# EAGLE design SPv2.1 (EAGLE 7.1.0)

## Sheet 1 of 2
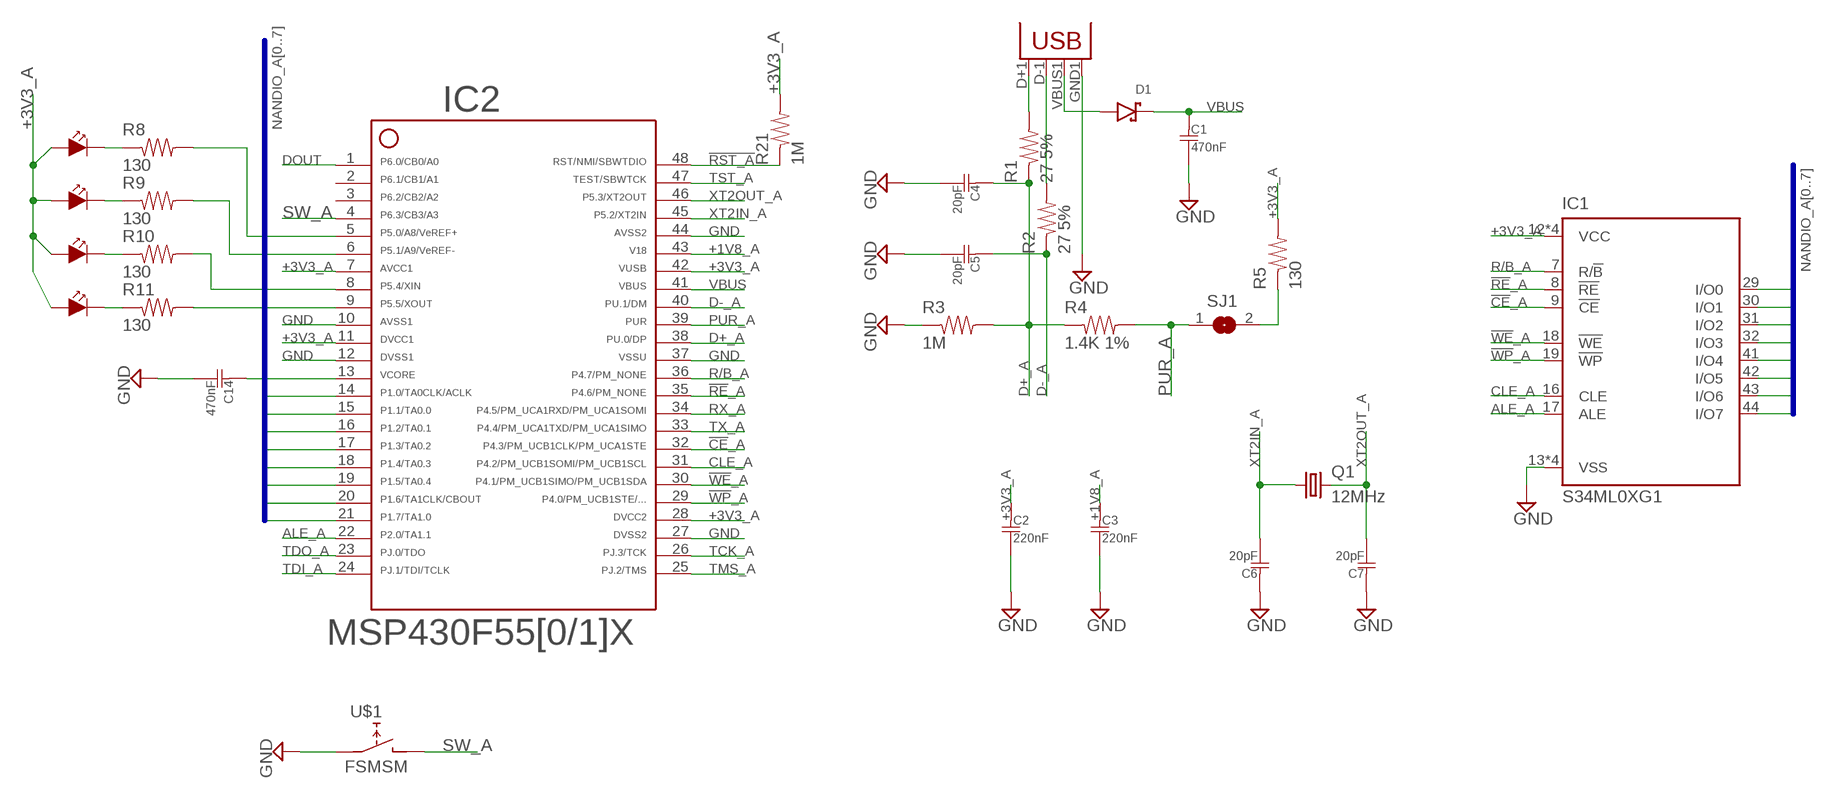
[diagram p0: schematic, sheet 1]

### Parts
C1  470nF  C0805  [R0805]
C2  220nF  C0805  [R0805]
C3  220nF  C0805  [R0805]
C4  20pF  C0805  [R0805]
C5  20pF  C0805  [R0805]
C6  20pF  C0805  [R0805]
C7  20pF  C0805  [R0805]
C14  470nF  C0805  [R0805]
D1  D-SCHOTTKY  [SOD123]
IC1  S34ML0XG1  [TSOP48]
IC2  F5508  F55[0/1]X---PT48  [PT48]
JP1  USBA-SMD-MALE  [USB-A-SMT-MALE]
Q1  12MHz  CRYSTALCSM-3X  [CSM-3X]
R1  27 5%  R0805  [R0805]
R2  27 5%  R0805  [R0805]
R3  1M  R0805  [R0805]
R4  1.4K 1%  R0805  [R0805]
R5  130  R0805  [R0805]
R8  130  R0805  [R0805]
R9  130  R0805  [R0805]
R10  130  R0805  [R0805]
R11  130  R0805  [R0805]
R21  1M  R0805  [R0805]
SJ1  SJW  [SJW]
U$1  FSMSM  [FSMSM]
U$5  LED  [LED0805]
U$6  LED  [LED0805]
U$7  LED  [LED0805]
U$8  LED  [LED0805]

### Nets
!CE!_A: IC1.9(!CE) IC2.32
!RE!_A: IC1.8(!RE) IC2.35
!RST_A!: IC2.48 R21.P$1
!WE!_A: IC1.18(!WE) IC2.30
!WP!_A: IC1.19(!WP) IC2.29
+1V8_A: C3.P$1 IC2.43
+3V3_A: C2.P$1 IC1.12(VCC) IC1.34(VCC) IC1.37(VCC) IC1.39(VCC) IC2.7 IC2.11 IC2.28 IC2.42 R5.P$2 R21.P$2 U$5.ANODE U$6.ANODE U$7.ANODE U$8.ANODE
ALE_A: IC1.17(ALE) IC2.22
CLE_A: IC1.16(CLE) IC2.31
D+_A: C4.P$1 IC2.38 R1.P$1 R3.P$2 R4.P$1
D-_A: C5.P$1 IC2.40 R2.P$1
DOUT: IC2.1 ; also sheet 2
GND: C1.P$2 C2.P$2 C3.P$2 C4.P$2 C5.P$2 C6.P$1 C7.P$1 C14.P$2 IC1.13(VSS) IC1.25(VSS) IC1.36(VSS) IC1.48(VSS) IC2.10 IC2.12 IC2.27 IC2.37 IC2.44 JP1.GND1(GND) R3.P$1 U$1.P$1(A1) ; also sheet 2
N$1: JP1.D+1(D+) R1.P$2
N$2: JP1.D-1(D-) R2.P$2
N$3: C14.P$1 IC2.13
N$4: R5.P$1 SJ1.2
N$19: IC2.9 R11.P$2
N$22: R10.P$1 U$7.CATHODE
N$23: R9.P$1 U$6.CATHODE
N$24: R8.P$1 U$5.CATHODE
N$25: R11.P$1 U$8.CATHODE
N$26: IC2.8 R10.P$2
N$27: IC2.6 R9.P$2
N$28: IC2.5 R8.P$2
N$33: D1.ANODE JP1.VBUS1(VBUS)
NANDIO_A0: IC1.29(I/O0) IC2.14
NANDIO_A1: IC1.30(I/O1) IC2.15
NANDIO_A2: IC1.31(I/O2) IC2.16
NANDIO_A3: IC1.32(I/O3) IC2.17
NANDIO_A4: IC1.41(I/O4) IC2.18
NANDIO_A5: IC1.42(I/O5) IC2.19
NANDIO_A6: IC1.43(I/O6) IC2.20
NANDIO_A7: IC1.44(I/O7) IC2.21
PUR_A: IC2.39 R4.P$2 SJ1.1
R/B_A: IC1.7(R/!B) IC2.36
RX_A: IC2.34 ; also sheet 2
SW_A: IC2.4 U$1.P$2(B)
TCK_A: IC2.26
TDI_A: IC2.24
TDO_A: IC2.23
TMS_A: IC2.25
TST_A: IC2.47
TX_A: IC2.33 ; also sheet 2
VBUS: C1.P$1 D1.CATHODE IC2.41 ; also sheet 2
XT2IN_A: C6.P$2 IC2.45 Q1.P$1
XT2OUT_A: C7.P$2 IC2.46 Q1.P$2
Unconnected: IC2.2 IC2.3

### Buses
NANDIO_A[0..7]

## Sheet 2 of 2
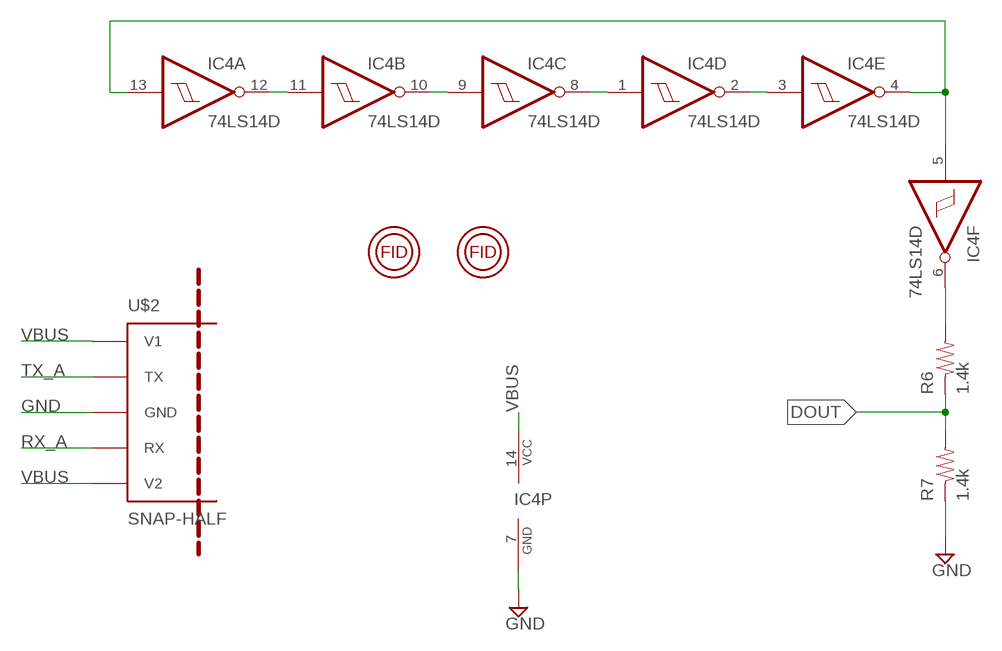
[diagram p1: schematic, sheet 2]

### Parts
IC4  74LS14D  [SO14]
R6  1.4k  R0805  [R0805]
R7  1.4k  R0805  [R0805]
U$2  SNAP-HALF  [SNAP-HALF]
U$3  FIDUCAL  [FIDUCAL]
U$12  FIDUCAL  [FIDUCAL]

### Nets
DOUT: R6.P$1 R7.P$2 ; also sheet 1
GND: IC4.7(P:GND) R7.P$1 U$2.P$3(GND) ; also sheet 1
N$5: IC4.11(B:I) IC4.12(A:O)
N$6: IC4.9(C:I) IC4.10(B:O)
N$7: IC4.1(D:I) IC4.8(C:O)
N$8: IC4.2(D:O) IC4.3(E:I)
N$9: IC4.4(E:O) IC4.5(F:I) IC4.13(A:I)
N$10: IC4.6(F:O) R6.P$2
RX_A: U$2.P$4(RX) ; also sheet 1
TX_A: U$2.P$2(TX) ; also sheet 1
VBUS: IC4.14(P:VCC) U$2.P$1(V1) U$2.P$5(V2) ; also sheet 1

## Library data of the parts
C1-C7 C14 = Passives:C
D1 = Passives:D-SCHOTTKY
IC1 = Flash:S34ML0XG1: Spansion 1GB, 2GB, and 4GB x8 NAND Flash Memory In x8 I/O mode
IC2 = TI_MSP430_v16:F55[0/1]X---PT48: ***F55[0/1/2]X*** PT48 Rev. 1.0 06/2010 "http://www.ti.com/lit/gpn/msp430f5509" Only for FF5504, F5508,F5509,F5510
IC4 = 74xx-us:74*14: Hex schmitt trigger INVERTER
JP1 = Passives:USB: USB Connectors USB-B-PTH is fully proven SKU : PRT-00139/CONN-08278 USB-miniB is fully proven SKU : PRT-00587 USB-A-PCB is untested. USB-A-H is throughly reviewed, but untested. Spark Fun Electronics SKU : PRT-00437 USB-B-SMT is throughly reviewed, but untested. Needs silkscreen touching up. USB-A-S has not been used/tested USB-MB-H has not been used/tested USB-MICROB has been used. CONN-09505
Q1 = Passives:CRYSTAL: CRYSTAL
R1-R11 R21 = Passives:R: A standard resistor.
SJ1 = jumper:SJ: SMD solder JUMPER
U$1 = Passives:FSMSM
U$2 = Passives:SNAP-HALF
U$3 U$12 = Passives:FIDUCAL
U$5-U$8 = Passives:LED

## Board
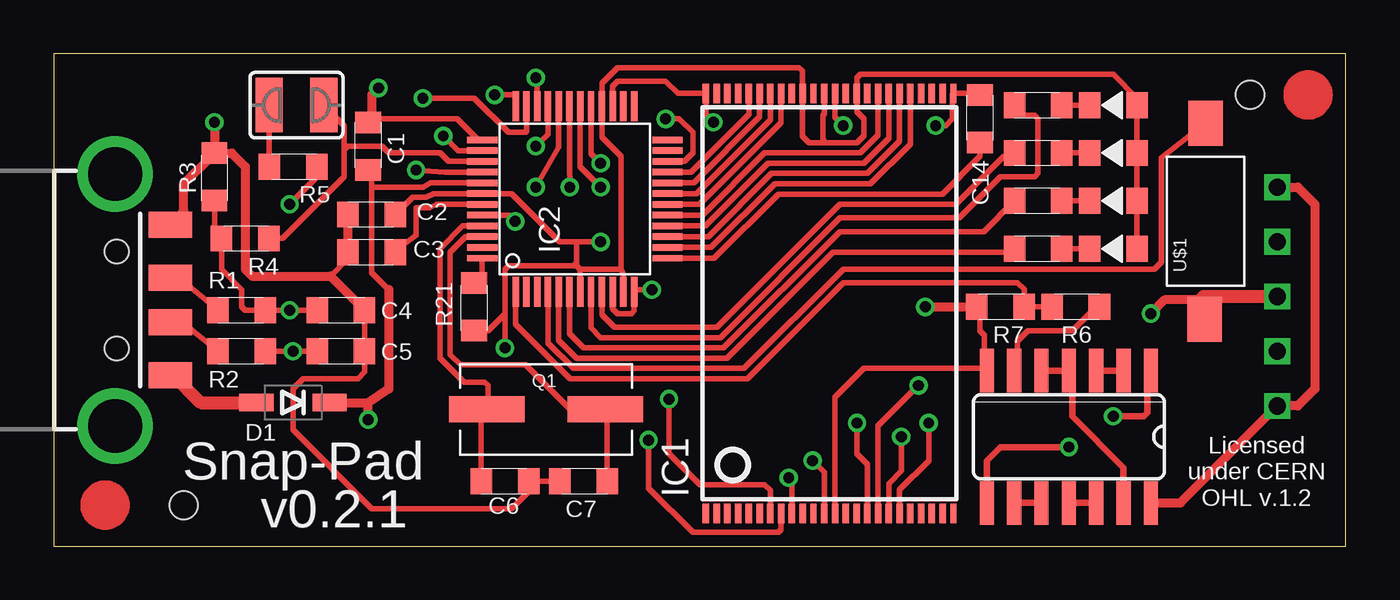
[diagram p2: board, top side]
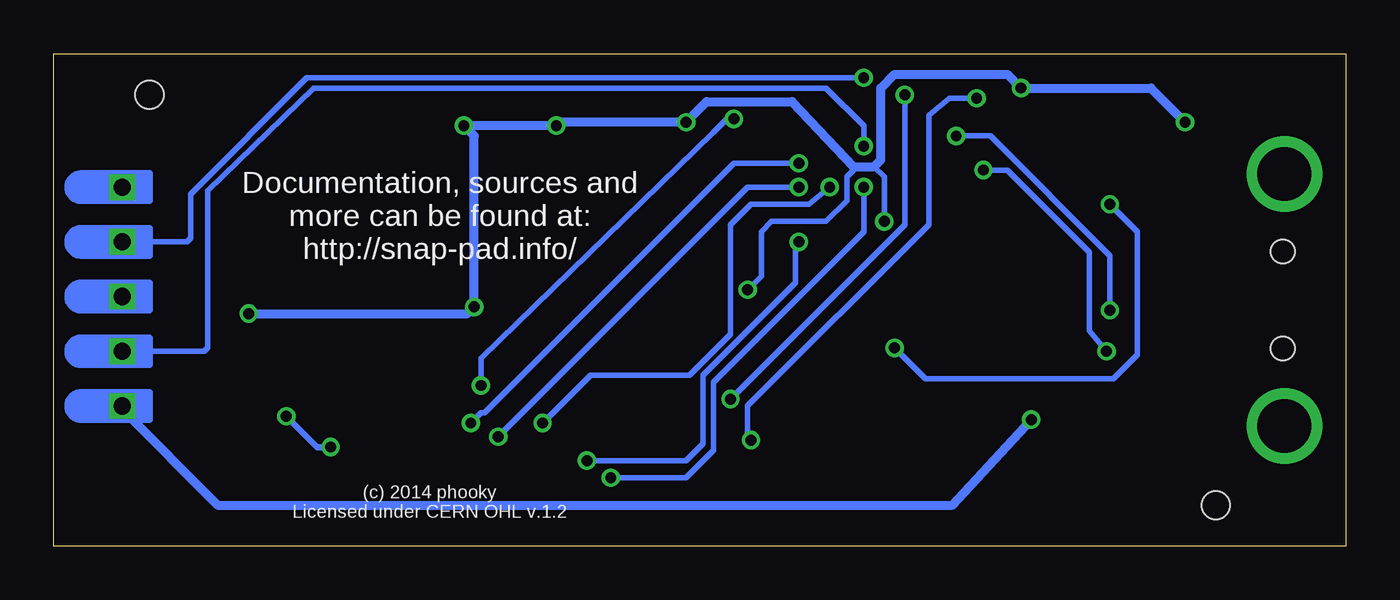
[diagram p3: board, bottom side, seen from below]

Size 60.01 x 22.86 mm. Coordinates in mm from the lower left corner, seen from the top.
Outline: 5.56,0 60.01,0 60.01,22.86 5.56,22.86 0,22.86 0,17.46 0,5.4 0,0 5.56,0
Copper layers (1*16): Top 0.0356mm / dielectric 1.5011mm / Bottom 0.0356mm
Design rules "LaenPCBOrder": minimum track width 6mil, minimum drill 13mil, track to track 6mil, track to pad 6mil, pad to pad 6mil, via to via 6mil, smd to smd 6mil, copper to edge 15mil, drill to drill 6mil, minimum pad ring 7mil, minimum via ring 7mil, stop-mask expansion 3mil, vias tented up to drill 0mil, thermal gap 10mil
Holes 1.3 mm at 6.03,1.91 55.56,20.95

### Footprints (pad centres in the part's own frame; a part is rotated, then mirrored left to right if it is on the bottom)
R0805 = smd 1 x 1.2: P$1 1.1,0; P$2 -1.1,0
SOD123 = smd 1.6 x 0.8: ANODE 1.7,0; CATHODE -1.7,0
TSOP48 = smd 0.9 x 0.3: 1 -9.75,5.75; 2 -9.75,5.25; 3 -9.75,4.75; 4 -9.75,4.25; 5 -9.75,3.75; 6 -9.75,3.25; 7 -9.75,2.75; 8 -9.75,2.25; 9 -9.75,1.75; 10 -9.75,1.25; 11 -9.75,0.75; 12 -9.75,0.25; 13 -9.75,-0.25; 14 -9.75,-0.75; 15 -9.75,-1.25; 16 -9.75,-1.75; 17 -9.75,-2.25; 18 -9.75,-2.75; 19 -9.75,-3.25; 20 -9.75,-3.75; 21 -9.75,-4.25; 22 -9.75,-4.75; 23 -9.75,-5.25; 24 -9.75,-5.75; 25 9.75,-5.75; 26 9.75,-5.25; 27 9.75,-4.75; 28 9.75,-4.25; 29 9.75,-3.75; 30 9.75,-3.25; 31 9.75,-2.75; 32 9.75,-2.25; 33 9.75,-1.75; 34 9.75,-1.25; 35 9.75,-0.75; 36 9.75,-0.25; 37 9.75,0.25; 38 9.75,0.75; 39 9.75,1.25; 40 9.75,1.75; 41 9.75,2.25; 42 9.75,2.75; 43 9.75,3.25; 44 9.75,3.75; 45 9.75,4.25; 46 9.75,4.75; 47 9.75,5.25; 48 9.75,5.75
PT48 = smd 1.4 x 0.3: 1 -4.3,2.75; 2 -4.3,2.25; 3 -4.3,1.75; 4 -4.3,1.25; 5 -4.3,0.75; 6 -4.3,0.25; 7 -4.3,-0.25; 8 -4.3,-0.75; 9 -4.3,-1.25; 10 -4.3,-1.75; 11 -4.3,-2.25; 12 -4.3,-2.75; 25 4.3,-2.75; 26 4.3,-2.25; 27 4.3,-1.75; 28 4.3,-1.25; 29 4.3,-0.75; 30 4.3,-0.25; 31 4.3,0.25; 32 4.3,0.75; 33 4.3,1.25; 34 4.3,1.75; 35 4.3,2.25; 36 4.3,2.75 | smd 0.3 x 1.4: 13 -2.75,-4.3; 14 -2.25,-4.3; 15 -1.75,-4.3; 16 -1.25,-4.3; 17 -0.75,-4.3; 18 -0.25,-4.3; 19 0.25,-4.3; 20 0.75,-4.3; 21 1.25,-4.3; 22 1.75,-4.3; 23 2.25,-4.3; 24 2.75,-4.3; 37 2.75,4.3; 38 2.25,4.3; 39 1.75,4.3; 40 1.25,4.3; 41 0.75,4.3; 42 0.25,4.3; 43 -0.25,4.3; 44 -0.75,4.3; 45 -1.25,4.3; 46 -1.75,4.3; 47 -2.25,4.3; 48 -2.75,4.3
SO14 = smd 0.66 x 2.032: 1 -3.81,-3.073; 2 -2.54,-3.073; 3 -1.27,-3.073; 4 0,-3.073; 5 1.27,-3.073; 6 2.54,-3.073; 7 3.81,-3.073; 8 3.81,3.073; 9 2.54,3.073; 10 1.27,3.073; 11 0,3.073; 12 -1.27,3.073; 13 -2.54,3.073; 14 -3.81,3.073
USB-A-SMT-MALE = smd 1.2 x 2: D+1 1.027,-3.67; D-1 -1.027,-3.67; GND1 3.5,-3.67; VBUS1 -3.5,-3.67 | drill 2.5 pad 2.9: P$1 -5.85,-1.1; P$2 5.85,-1.1 | hole 1.1: 2.25,-1.17; -2.25,-1.17
CSM-3X = smd 3.5 x 1.2: P$1 -2.75,0; P$2 2.75,0
SJW = smd 1.27 x 2.54: 1 -1.27,0; 2 1.27,0
FSMSM = smd 2.1 x 1.6: P$1 -4.55,0.05; P$2 4.55,0
SNAP-HALF = drill 0.8 square: P$1 -3.81,5.08; P$2 -3.81,2.54; P$3 -3.81,0; P$4 -3.81,-2.54; P$5 -3.81,-5.08
LED0805 = smd 1 x 1.2: ANODE -1.1,0; CATHODE 1.1,0

### Placement (x,y rotation side)
C1  14.61,18.57 270 top
C2  14.76,15.4 0 top
C3  14.76,13.65 0 top
C4  13.34,10.95 180 top
C5  13.34,9.05 180 top
C6  20.95,3.02 0 top
C7  24.61,3.02 180 top
C14  43.02,19.84 270 top
D1  11.11,6.67 180 top
IC1  36.04,11.27 90 top
IC2  24.2,16.12 90 top
IC4  47.15,5.08 180 top
JP1  1.75,11.43 90 top
Q1  22.86,6.35 0 top
R1  8.73,10.95 0 top
R2  8.73,9.05 0 top
R3  7.46,17.14 90 top
R4  8.89,14.29 180 top
R5  11.11,17.62 180 top
R6  47.47,11.11 180 top
R7  43.97,11.11 180 top
R8  45.72,13.81 0 top
R9  45.72,16.03 0 top
R10  45.72,20.48 0 top
R11  45.72,18.26 0 top
R21  19.53,11.11 90 top
SJ1  11.27,20.48 180 top
U$1  53.5,15.08 90 top
U$2  60.64,11.59 180 bottom
U$3  2.38,1.91 0 top
U$5  49.21,13.81 180 top
U$6  49.21,16.03 180 top
U$7  49.21,20.48 180 top
U$8  49.21,18.26 180 top
U$12  58.26,20.95 0 top

### Tracks (layer width: path | path; a pad name or v marks a point on that pad's centre or on a via)
!CE!_A  (via drill 0.5)
  Top 0.254: IC2.32 23.45,18.53 v22.38,16.67 | v34.13,3.17 34.29,3.02 IC1.9
  Bottom 0.254: v22.38,16.67 22.38,14.61 29.37,7.62 29.37,4.45 30.64,3.17 v34.13,3.17
!RE!_A  (via drill 0.5)
  Top 0.254: IC2.35 21.95,19.25 21.91,19.21 21.11,19.21 19.53,20.8 v17.14,20.8 | v27.62,4.92 27.62,2.7 29.69,0.64 33.66,0.64 33.79,0.77 IC1.8
  Bottom 0.254: v17.14,20.8 18.41,20.8 19.37,20 19.37,14.92 27.78,6.51 27.78,5.08 v27.62,4.92
!RST_A!
  Top 0.254: IC2.48 19.9,12.59 R21.P$1
!WE!_A  (via drill 0.5)
  Top 0.254: IC2.30 24.45,17.61 v25.4,16.67 | v39.37,5.08 39.37,3.49 38.79,2.91 IC1.18
  Bottom 0.254: v25.4,16.67 27.78,16.67 v39.37,5.08
!WP!_A  (via drill 0.5)
  Top 0.254: IC2.29 24.95,18.23 v25.4,17.78 | v40.64,5.71 40.64,3.97 39.29,2.62 IC1.19
  Bottom 0.254: v25.4,17.78 28.42,17.78 40.01,6.19 40.16,6.19 v40.64,5.71
+1V8_A
  Top 0.254: IC2.43 17.77,15.87 17.46,15.72 16.83,15.72 16.83,14.45 16.19,13.98 C3.P$1
+3V3_A  (via drill 0.5)
  Top 0.254: IC2.11 26.45,12.6 26.35,12.86 | 26.35,12.86 24.45,12.86 | IC2.7 24.45,12.55 24.45,12.86 | U$5.ANODE U$6.ANODE U$8.ANODE U$7.ANODE 50.31,20.81 49.21,21.91 37.47,21.91 37.31,21.75 37.31,21.04 IC1.34 37.31,21 37.31,20.16 37.62,19.84 37.62,19.05 37.31,18.73 35.88,18.73 | IC1.37 35.79,20.07 35.72,20 35.72,18.89 35.88,18.73 | 35.88,18.73 35.08,18.73 34.79,19.03 IC1.39 34.77,21.04 34.77,22.07 34.61,22.23 26.19,22.23 25.45,21.48 IC2.28 25.45,19 26.35,18.1 26.35,12.86 | C2.P$1 16.66,16.19 17.3,16.19 17.64,16.37 IC2.42 21.25,16.37 23.5,14.13 24.29,14.13 | 24.45,12.86 24.29,13.02 24.29,13.18 | 24.29,14.13 24.29,13.18 | IC1.12 35.79,3.42 v35.24,3.97 | v25.4,14.13 24.29,14.13 | R21.P$2 20.17,10.01 20.95,10.79 | 20.95,10.79 20.95,12.86 21.11,13.02 24.13,13.02 24.29,13.18 | R5.P$2 12.21,17.13 v10.95,15.88 | v20.95,9.21 20.95,10.79
  Bottom 0.254: v35.24,3.97 30.64,3.97 29.84,4.76 29.84,7.94 25.56,12.22 25.56,13.97 v25.4,14.13 | v10.95,15.88 9.68,14.61 9.68,8.89 10.79,7.78 19.53,7.78 v20.95,9.21
ALE_A  (via drill 0.5)
  Top 0.254: IC1.17 38.29,5.58 v40.16,7.46 | v28.42,19.84 29.05,19.84 29.69,19.21 29.69,18.26 29.3,17.87 IC2.22
  Bottom 0.254: v40.16,7.46 40.16,8.73 29.37,19.21 28.73,19.84 v28.42,19.84
CLE_A  (via drill 0.5)
  Top 0.254: IC2.31 23.95,17.76 v23.97,16.67 | IC1.16 37.79,3.81 37.31,4.29 v37.31,5.71
  Bottom 0.254: v23.97,16.67 24.92,15.88 27.62,15.88 28.57,14.92 28.57,9.84 30.48,7.94 35.08,7.94 v37.31,5.71
D+_A  (via drill 0.5)
  Top 0.254: C4.P$1 v10.95,10.95 R1.P$1 8.89,10.95 8.73,11.11 8.73,11.91 7.79,12.85 R4.P$1 7.46,14.62 R3.P$2 | IC2.38 18.78,18.37 v18.1,19.05
  Bottom 0.254: 10.95,11.34 v10.95,10.95 10.95,13.49 16.51,19.05 v18.1,19.05
D-_A  (via drill 0.5)
  Top 0.254: IC2.40 18.19,17.37 v16.83,17.46 | C5.P$1 v11.11,9.05 R2.P$1
  Bottom 0.254: v16.83,17.46 15.72,17.46 11.91,13.65 11.91,10 v11.11,9.05
DOUT
  Top 0.254: IC2.1 21.45,10.3 23.81,7.94 23.97,7.78 32.23,7.78 36.67,12.22 44.77,12.22 45.07,11.92 R7.P$2 R6.P$1
GND  (via drill 0.5)
  Top 0.254: IC2.10 25.95,11.04 26.19,10.79 26.83,10.79 26.95,10.92 IC2.12 27.04,11.91 v27.78,11.91 | IC1.36 36.29,19.91 v36.67,19.53 | v40.96,19.53 41.43,19.53 41.75,19.84 41.75,20.99 IC1.25 42.94,21.02 C14.P$2 | IC1.13 36.29,6.92 37.62,8.26 43.24,8.26 | 43.24,8.26 IC4.7 | IC2.27 25.95,21.35 26.19,21.59 28.42,21.59 28.98,21.02 IC1.48 30.29,20.04 v30.64,19.68 | IC2.37 19.71,18.87 18.73,19.84 14.78,19.84 C1.P$2 | C4.P$2 C5.P$2 14.45,9.04 14.45,8.1 14.13,7.78 11.59,7.78 11.11,7.3 11.11,5.4 14.76,1.75 21.27,1.75 22.05,2.53 C6.P$1 C7.P$1 | 43.24,8.26 43.24,9.79 43.02,10 43.02,10.96 R7.P$1 | C3.P$2 13.66,13.36 12.85,12.54 | IC2.44 21.14,15.37 v21.43,15.08
  Top 0.406: JP1.GND1 5.41,14.93 6.03,15.56 6.03,16.82 R3.P$1 | R3.P$1 8.27,18.25 8.89,17.62 8.89,12.86 9.21,12.54 12.85,12.54 C4.P$2 14.62,11.13 | C3.P$2 C2.P$2 | 53.24,11.43 51.59,11.43 v50.96,10.79 | v40.48,11.11 R7.P$1 | v7.46,19.68 R3.P$1 | 14.78,19.84 14.78,20.97 v15.08,21.27
  Top 0.61: 53.24,11.43 U$1.P$1 53.4,11.59 U$2.P$3
  Bottom 0.254: 36.51,19.68 v36.67,19.53 | 22.86,17.62 22.86,17.46 23.18,17.14 23.18,16.03 24.13,15.08 26.67,15.08 27.15,14.61 27.15,12.54 v27.78,11.91 | v21.43,15.08 21.43,17.14 21.91,17.62
  Bottom 0.406: v36.67,19.53 v40.96,19.53 40.48,19.05 v40.48,11.11 40.8,10.79 v50.96,10.79 | 36.51,19.68 v30.64,19.68 29.69,20.64 25.72,20.64 22.86,17.62 21.91,17.62 21.59,17.94 21.59,21.27 20.95,21.91 15.72,21.91 v15.08,21.27 9.05,21.27 v7.46,19.68
N$1
  Top 0.254: JP1.D+1 5.84,12.43 R1.P$2
N$2
  Top 0.254: JP1.D-1 5.93,10.43 R2.P$2
N$3
  Top 0.254: C14.P$1 43.02,18.1 41.27,16.35 33.66,16.35 30.67,13.37 IC2.13
N$4
  Top 0.254: SJ1.2 10,17.63 R5.P$1
N$5
  Top 0.305: IC4.11 IC4.12
N$6
  Top 0.305: IC4.9 IC4.10
N$7  (via drill 0.5)
  Top 0.305: IC4.8 43.34,3.97 43.97,4.6 v47.15,4.6 | v49.21,6.03 50.64,6.03 50.8,6.19 50.8,8 IC4.1
  Bottom 0.305: v47.15,4.6 47.78,4.6 v49.21,6.03
N$8
  Top 0.305: IC4.3 IC4.2
N$9
  Top 0.305: IC4.5 IC4.4 47.31,8 47.31,6.03 49.69,3.65 IC4.13
N$10
  Top 0.254: R6.P$2 48.42,11.11 47.31,10 45.24,10 44.77,9.53 44.77,8.31 IC4.6
N$19
  Top 0.254: IC2.9 25.45,10.74 26.04,10.16 30.8,10.16 36.51,15.88 41.91,15.88 44.13,18.1 44.46,18.1 R11.P$2
N$22
  Top 0.254: R10.P$1 U$7.CATHODE
N$23
  Top 0.254: R9.P$1 U$6.CATHODE
N$24
  Top 0.254: R8.P$1 U$5.CATHODE
N$25
  Top 0.254: R11.P$1 U$8.CATHODE
N$26
  Top 0.254: IC2.8 24.95,10.13 25.4,9.68 30.96,9.68 36.51,15.24 42.07,15.24 43.97,17.14 45.56,17.14 45.72,17.3 45.72,19.84 45.56,20 45.1,20 R10.P$2
N$27
  Top 0.254: IC2.6 23.95,9.86 24.61,9.21 31.11,9.21 36.51,14.61 43.19,14.61 R9.P$2
N$28
  Top 0.254: IC2.5 23.45,9.57 24.29,8.73 31.27,8.73 36.2,13.65 44.3,13.65 R8.P$2
N$33
  Top 0.61: JP1.VBUS1 5.56,7.93 6.83,6.67 D1.ANODE
NANDIO_A0
  Top 0.254: IC2.14 30.54,13.87 33.5,16.83 37.94,16.83 39.79,18.67 IC1.29
NANDIO_A1
  Top 0.254: IC2.15 30.4,14.37 33.34,17.3 37.78,17.3 39.29,18.81 IC1.30
NANDIO_A2
  Top 0.254: IC2.16 30.27,14.87 33.18,17.78 37.62,17.78 38.79,18.94 IC1.31
NANDIO_A3
  Top 0.254: IC2.17 30.13,15.37 33.02,18.26 37.47,18.26 38.29,19.08 IC1.32
NANDIO_A4
  Top 0.254: IC2.18 30,15.87 33.79,19.66 IC1.41
NANDIO_A5
  Top 0.254: IC2.19 29.86,16.37 33.29,19.79 IC1.42
NANDIO_A6
  Top 0.254: IC2.20 29.73,16.87 32.79,19.93 IC1.43
NANDIO_A7
  Top 0.254: IC2.21 29.59,17.37 32.29,20.06 IC1.44
PUR_A
  Top 0.254: IC2.39 18.33,17.87 17.94,18.26 15.56,18.26 15.24,18.57 13.65,18.57 13.49,18.41 | 13.49,18.41 13.49,19.53 SJ1.1 | R4.P$2 10.64,14.29 13.49,17.14 13.49,18.41
R/B_A  (via drill 0.5)
  Top 0.254: IC2.36 21.45,20.61 21.43,20.95 v20.48,20.95 | v28.57,6.83 28.57,4.29 30,2.86 33.02,2.86 33.29,2.59 IC1.7
  Bottom 0.254: v20.48,20.95 20.48,14.92 v28.57,6.83
RX_A  (via drill 0.5)
  Top 0.254: IC2.34 22.45,21.36 v22.38,21.75
  Bottom 0.254: v22.38,21.75 48.26,21.75 53.66,16.35 53.66,14.29 53.82,14.13 U$2.P$4
SW_A
  Top 0.254: IC2.4 22.95,9.43 24.13,8.26 32.07,8.26 36.67,12.86 51.12,12.86 51.44,13.18 51.44,18.04 U$1.P$2
TX_A  (via drill 0.5)
  Top 0.254: IC2.33 22.95,19.11 v22.38,18.57
  Bottom 0.254: v22.38,18.57 22.38,19.53 24.13,21.27 47.94,21.27 52.86,16.51 52.86,9.21 53.02,9.05 U$2.P$2
VBUS  (via drill 0.5)
  Top 0.254: IC2.41 17.5,16.87 17.14,16.67 14.76,16.67 | 14.76,16.67 14.76,12.7 15.56,11.91 | C1.P$1 14.75,17.47 14.76,17.46 14.76,16.67
  Top 0.406: D1.CATHODE 14.61,6.67 | 15.56,11.91 15.56,7.3 14.61,6.67 | U$2.P$5 57.78,16.67 58.58,15.88 58.58,7.3 57.78,6.51 U$2.P$1 52.33,2.01 IC4.14 | v14.61,5.87 14.61,6.67
  Bottom 0.406: U$2.P$1 56.83,6.35 52.39,1.91 18.26,1.91 v14.61,5.87
XT2IN_A
  Top 0.254: IC2.45 19,14.87 17.94,13.81 17.94,8.73 19.05,7.62 20,7.62 20.16,7.46 20.16,6.4 Q1.P$1 19.86,6.09 C6.P$2
XT2OUT_A
  Top 0.254: IC2.46 19.13,14.37 18.41,13.65 18.41,8.89 18.89,8.41 21.91,8.41 23.97,6.35 Q1.P$2 25.71,6.25 C7.P$2

### Text on the board
tPlace: Snap-Pad | Licensed / under CERN / OHL v.1.2 | v0.2.1
bPlace: Documentation, sources and / more can be found at: / http://snap-pad.info/ | (c) 2014 phooky / Licensed under CERN OHL v.1.2